# EAGLE design PGTN014_percussive_synth (EAGLE 9.6.0)
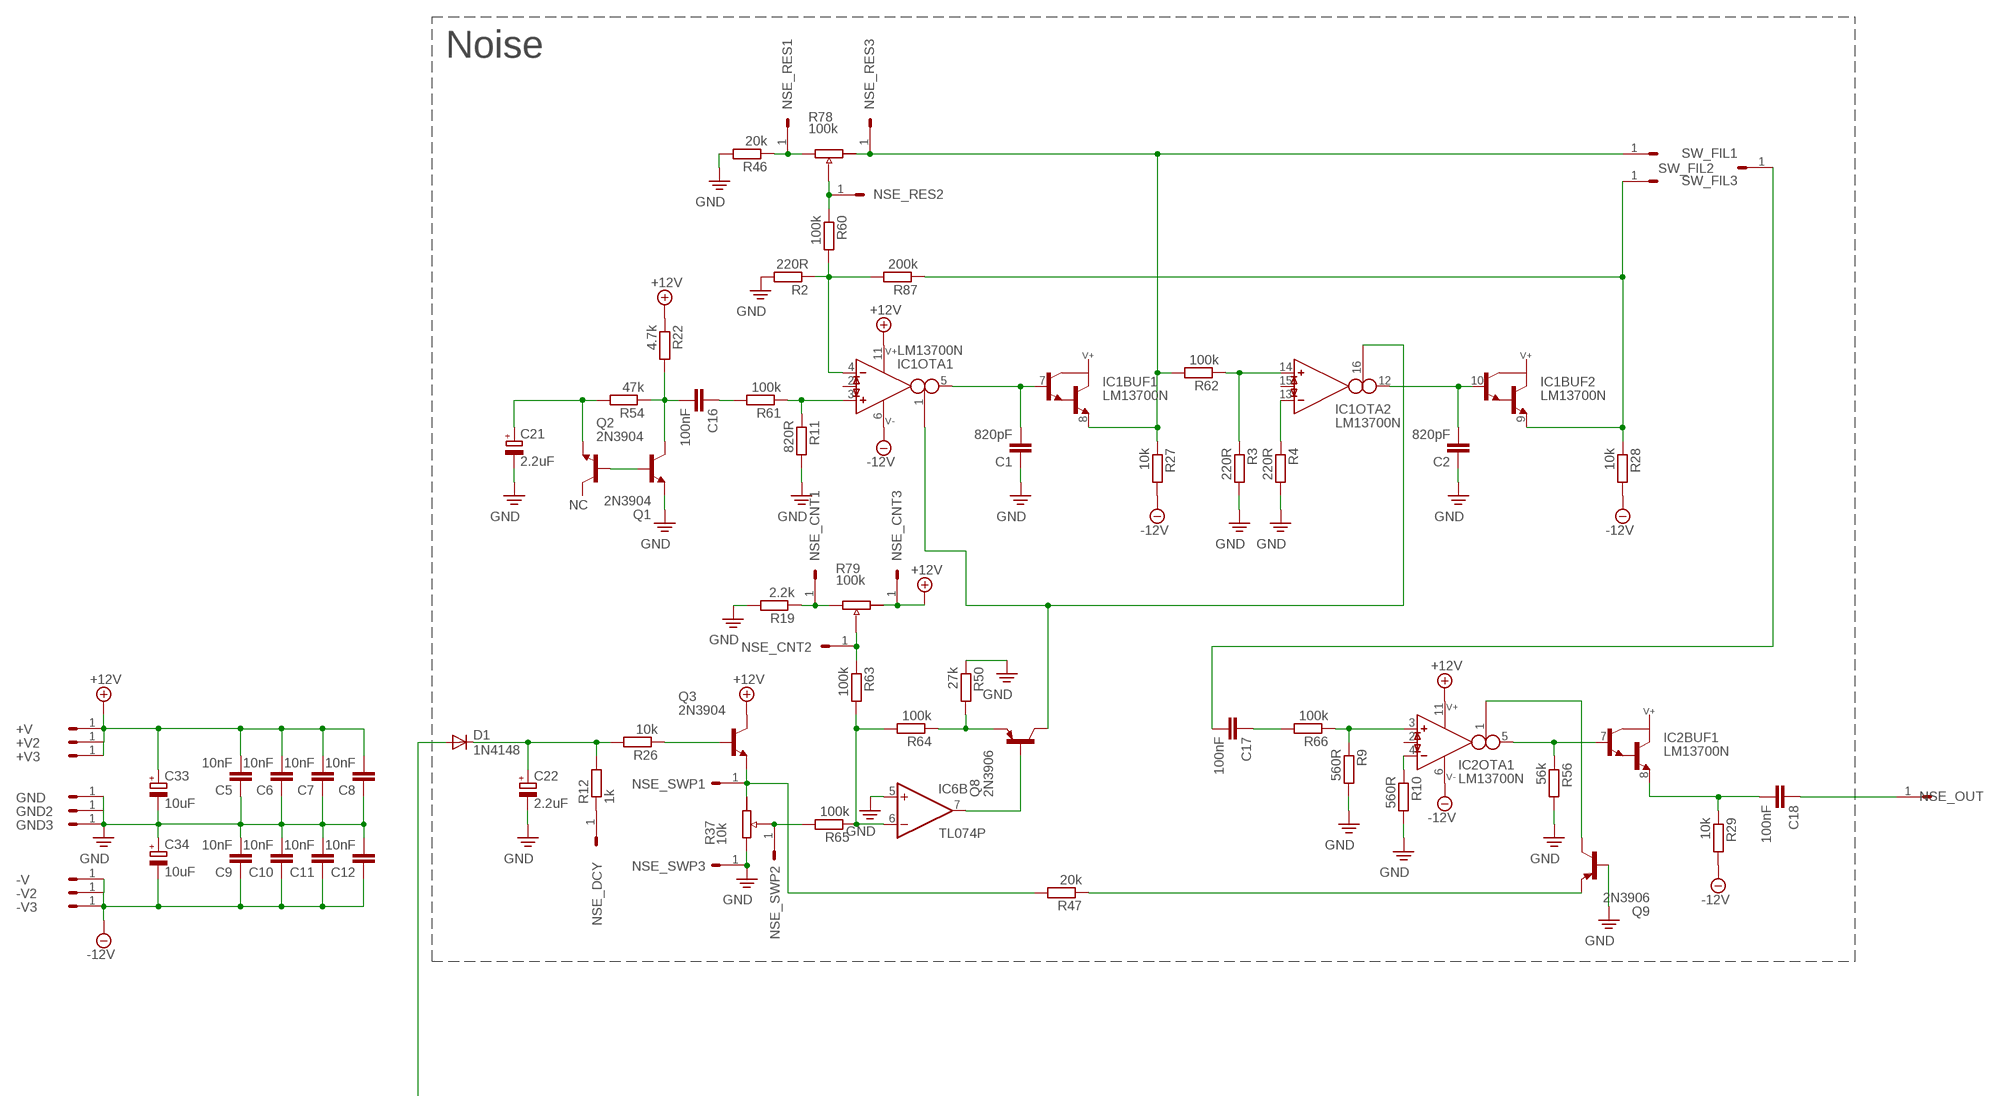
[diagram p0: schematic, sheet 1, part 1 of 2]
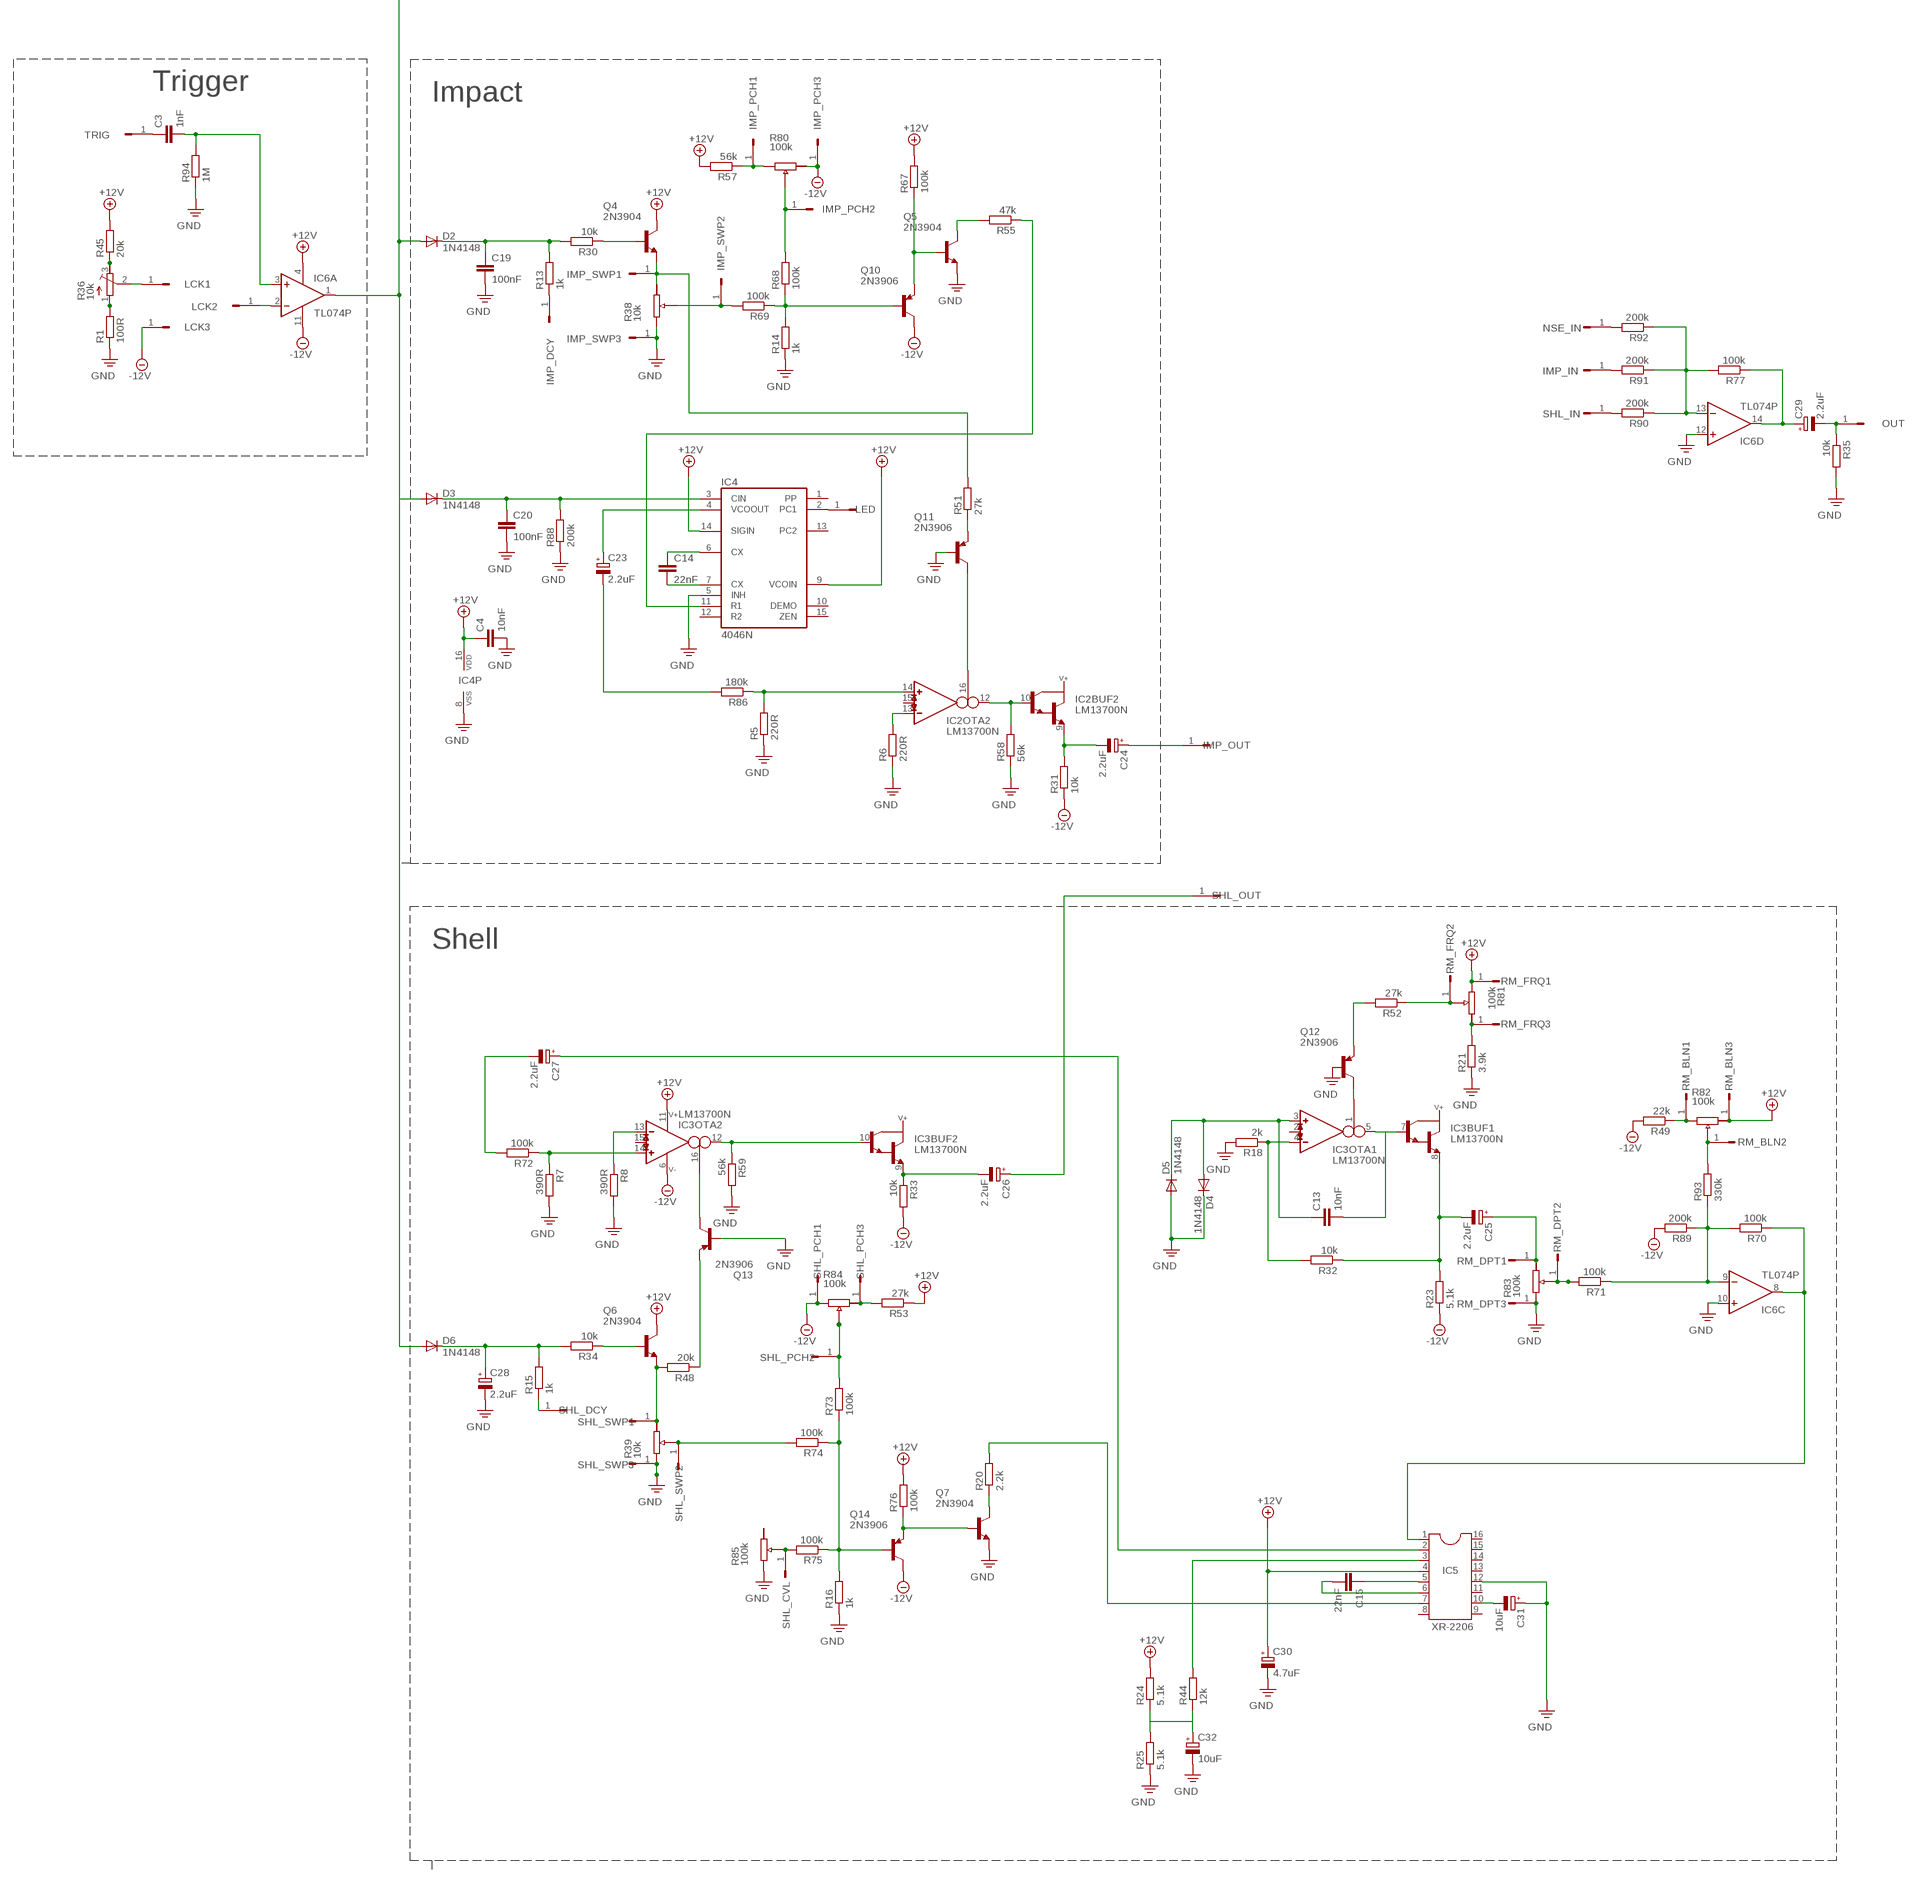
[diagram p1: schematic, sheet 1, part 2 of 2]

## Parts
+V  HEADER/MALE/01  [HEADER/MALE/01]
+V2  HEADER/MALE/01  [HEADER/MALE/01]
+V3  HEADER/MALE/01  [HEADER/MALE/01]
-V  HEADER/MALE/01  [HEADER/MALE/01]
-V2  HEADER/MALE/01  [HEADER/MALE/01]
-V3  HEADER/MALE/01  [HEADER/MALE/01]
C1  820pF  CAPACITORCERAMICDISC/5  [CERAMICDISC/5]
C2  820pF  CAPACITORCERAMICDISC/5  [CERAMICDISC/5]
C3  1nF  CAPACITORCERAMICDISC/5  [CERAMICDISC/5]
C4  10nF  CAPACITORCERAMICDISC/5  [CERAMICDISC/5]
C5  10nF  CAPACITORCERAMICDISC/5  [CERAMICDISC/5]
C6  10nF  CAPACITORCERAMICDISC/5  [CERAMICDISC/5]
C7  10nF  CAPACITORCERAMICDISC/5  [CERAMICDISC/5]
C8  10nF  CAPACITORCERAMICDISC/5  [CERAMICDISC/5]
C9  10nF  CAPACITORCERAMICDISC/5  [CERAMICDISC/5]
C10  10nF  CAPACITORCERAMICDISC/5  [CERAMICDISC/5]
C11  10nF  CAPACITORCERAMICDISC/5  [CERAMICDISC/5]
C12  10nF  CAPACITORCERAMICDISC/5  [CERAMICDISC/5]
C13  10nF  CAPACITORCERAMICDISC/5  [CERAMICDISC/5]
C14  22nF  CAPACITORCERAMICDISC/5  [CERAMICDISC/5]
C15  22nF  CAPACITORCERAMICDISC/5  [CERAMICDISC/5]
C16  100nF  CAPACITORCERAMICDISC/5  [CERAMICDISC/5]
C17  100nF  CAPACITORCERAMICDISC/5  [CERAMICDISC/5]
C18  100nF  CAPACITORCERAMICDISC/5  [CERAMICDISC/5]
C19  100nF  CAPACITORCERAMICDISC/5  [CERAMICDISC/5]
C20  100nF  CAPACITORCERAMICDISC/5  [CERAMICDISC/5]
C21  2.2uF  CAPACITOR/POLARIZEDE2.5-6  [E2,5-6]
C22  2.2uF  CAPACITOR/POLARIZEDE2.5-6  [E2,5-6]
C23  2.2uF  CAPACITOR/POLARIZEDE2.5-6  [E2,5-6]
C24  2.2uF  CAPACITOR/POLARIZEDE2.5-6  [E2,5-6]
C25  2.2uF  CAPACITOR/POLARIZEDE2.5-6  [E2,5-6]
C26  2.2uF  CAPACITOR/POLARIZEDE2.5-6  [E2,5-6]
C27  2.2uF  CAPACITOR/POLARIZEDE2.5-6  [E2,5-6]
C28  2.2uF  CAPACITOR/POLARIZEDE2.5-6  [E2,5-6]
C29  2.2uF  CAPACITOR/POLARIZEDE2.5-6  [E2,5-6]
C30  4.7uF  CAPACITOR/POLARIZEDE2.5-6  [E2,5-6]
C31  10uF  CAPACITOR/POLARIZEDE2.5-6  [E2,5-6]
C32  10uF  CAPACITOR/POLARIZEDE2.5-6  [E2,5-6]
C33  10uF  CAPACITOR/POLARIZEDE2.5-6  [E2,5-6]
C34  10uF  CAPACITOR/POLARIZEDE2.5-6  [E2,5-6]
D1  1N4148  1N4148DO35-7  [DO35-7]
D2  1N4148  1N4148DO35-7  [DO35-7]
D3  1N4148  1N4148DO35-7  [DO35-7]
D4  1N4148  1N4148DO35-7  [DO35-7]
D5  1N4148  1N4148DO35-7  [DO35-7]
D6  1N4148  1N4148DO35-7  [DO35-7]
GND  HEADER/MALE/01  [HEADER/MALE/01]
GND2  HEADER/MALE/01  [HEADER/MALE/01]
GND3  HEADER/MALE/01  [HEADER/MALE/01]
IC1  LM13700N  [DIL16]
IC2  LM13700N  [DIL16]
IC3  LM13700N  [DIL16]
IC4  4046N  [DIL16]
IC5  XR-2206  DIL16  [DIL16]
IC6  TL074P  [DIL14]
IMP_DCY  HEADER/MALE/01  [HEADER/MALE/01]
IMP_IN  HEADER/MALE/01  [HEADER/MALE/01]
IMP_OUT  HEADER/MALE/01  [HEADER/MALE/01]
IMP_PCH1  HEADER/MALE/01  [HEADER/MALE/01]
IMP_PCH2  HEADER/MALE/01  [HEADER/MALE/01]
IMP_PCH3  HEADER/MALE/01  [HEADER/MALE/01]
IMP_SWP1  HEADER/MALE/01  [HEADER/MALE/01]
IMP_SWP2  HEADER/MALE/01  [HEADER/MALE/01]
IMP_SWP3  HEADER/MALE/01  [HEADER/MALE/01]
LCK1  HEADER/MALE/01  [HEADER/MALE/01]
LCK2  HEADER/MALE/01  [HEADER/MALE/01]
LCK3  HEADER/MALE/01  [HEADER/MALE/01]
LED  HEADER/MALE/01  [HEADER/MALE/01]
NSE_CNT1  HEADER/MALE/01  [HEADER/MALE/01]
NSE_CNT2  HEADER/MALE/01  [HEADER/MALE/01]
NSE_CNT3  HEADER/MALE/01  [HEADER/MALE/01]
NSE_DCY  HEADER/MALE/01  [HEADER/MALE/01]
NSE_IN  HEADER/MALE/01  [HEADER/MALE/01]
NSE_OUT  HEADER/MALE/01  [HEADER/MALE/01]
NSE_RES1  HEADER/MALE/01  [HEADER/MALE/01]
NSE_RES2  HEADER/MALE/01  [HEADER/MALE/01]
NSE_RES3  HEADER/MALE/01  [HEADER/MALE/01]
NSE_SWP1  HEADER/MALE/01  [HEADER/MALE/01]
NSE_SWP2  HEADER/MALE/01  [HEADER/MALE/01]
NSE_SWP3  HEADER/MALE/01  [HEADER/MALE/01]
OUT  HEADER/MALE/01  [HEADER/MALE/01]
Q1  2N3904  [TO92]
Q2  2N3904  [TO92]
Q3  2N3904  [TO92]
Q4  2N3904  [TO92]
Q5  2N3904  [TO92]
Q6  2N3904  [TO92]
Q7  2N3904  [TO92]
Q8  2N3906  [TO92]
Q9  2N3906  [TO92]
Q10  2N3906  [TO92]
Q11  2N3906  [TO92]
Q12  2N3906  [TO92]
Q13  2N3906  [TO92]
Q14  2N3906  [TO92]
R1  100R  RESISTORRESISTOR/UPRIGHT/7.5  [RESISTOR/7.5]
R2  220R  RESISTORRESISTOR/UPRIGHT/7.5  [RESISTOR/7.5]
R3  220R  RESISTORRESISTOR/UPRIGHT/7.5  [RESISTOR/7.5]
R4  220R  RESISTORRESISTOR/UPRIGHT/7.5  [RESISTOR/7.5]
R5  220R  RESISTORRESISTOR/UPRIGHT/7.5  [RESISTOR/7.5]
R6  220R  RESISTORRESISTOR/UPRIGHT/7.5  [RESISTOR/7.5]
R7  390R  RESISTORRESISTOR/UPRIGHT/7.5  [RESISTOR/7.5]
R8  390R  RESISTORRESISTOR/UPRIGHT/7.5  [RESISTOR/7.5]
R9  560R  RESISTORRESISTOR/UPRIGHT/7.5  [RESISTOR/7.5]
R10  560R  RESISTORRESISTOR/UPRIGHT/7.5  [RESISTOR/7.5]
R11  820R  RESISTORRESISTOR/UPRIGHT/7.5  [RESISTOR/7.5]
R12  1k  RESISTORRESISTOR/UPRIGHT/7.5  [RESISTOR/7.5]
R13  1k  RESISTORRESISTOR/UPRIGHT/7.5  [RESISTOR/7.5]
R14  1k  RESISTORRESISTOR/UPRIGHT/7.5  [RESISTOR/7.5]
R15  1k  RESISTORRESISTOR/UPRIGHT/7.5  [RESISTOR/7.5]
R16  1k  RESISTORRESISTOR/UPRIGHT/7.5  [RESISTOR/7.5]
R18  2k  RESISTORRESISTOR/UPRIGHT/7.5  [RESISTOR/7.5]
R19  2.2k  RESISTORRESISTOR/UPRIGHT/7.5  [RESISTOR/7.5]
R20  2.2k  RESISTORRESISTOR/UPRIGHT/7.5  [RESISTOR/7.5]
R21  3.9k  RESISTORRESISTOR/UPRIGHT/7.5  [RESISTOR/7.5]
R22  4.7k  RESISTORRESISTOR/UPRIGHT/7.5  [RESISTOR/7.5]
R23  5.1k  RESISTORRESISTOR/UPRIGHT/7.5  [RESISTOR/7.5]
R24  5.1k  RESISTORRESISTOR/UPRIGHT/7.5  [RESISTOR/7.5]
R25  5.1k  RESISTORRESISTOR/UPRIGHT/7.5  [RESISTOR/7.5]
R26  10k  RESISTORRESISTOR/UPRIGHT/7.5  [RESISTOR/7.5]
R27  10k  RESISTORRESISTOR/UPRIGHT/7.5  [RESISTOR/7.5]
R28  10k  RESISTORRESISTOR/UPRIGHT/7.5  [RESISTOR/7.5]
R29  10k  RESISTORRESISTOR/UPRIGHT/7.5  [RESISTOR/7.5]
R30  10k  RESISTORRESISTOR/UPRIGHT/7.5  [RESISTOR/7.5]
R31  10k  RESISTORRESISTOR/UPRIGHT/7.5  [RESISTOR/7.5]
R32  10k  RESISTORRESISTOR/UPRIGHT/7.5  [RESISTOR/7.5]
R33  10k  RESISTORRESISTOR/UPRIGHT/7.5  [RESISTOR/7.5]
R34  10k  RESISTORRESISTOR/UPRIGHT/7.5  [RESISTOR/7.5]
R35  10k  RESISTORRESISTOR/UPRIGHT/7.5  [RESISTOR/7.5]
R36  10k  TRIMMER64X  [TRIMMER/64B]
R37  10k  POTENTIOMETER  (no package)
R38  10k  POTENTIOMETER  (no package)
R39  10k  POTENTIOMETER  (no package)
R44  12k  RESISTORRESISTOR/UPRIGHT/7.5  [RESISTOR/7.5]
R45  20k  RESISTORRESISTOR/UPRIGHT/7.5  [RESISTOR/7.5]
R46  20k  RESISTORRESISTOR/UPRIGHT/7.5  [RESISTOR/7.5]
R47  20k  RESISTORRESISTOR/UPRIGHT/7.5  [RESISTOR/7.5]
R48  20k  RESISTORRESISTOR/UPRIGHT/7.5  [RESISTOR/7.5]
R49  22k  RESISTORRESISTOR/UPRIGHT/7.5  [RESISTOR/7.5]
R50  27k  RESISTORRESISTOR/UPRIGHT/7.5  [RESISTOR/7.5]
R51  27k  RESISTORRESISTOR/UPRIGHT/7.5  [RESISTOR/7.5]
R52  27k  RESISTORRESISTOR/UPRIGHT/7.5  [RESISTOR/7.5]
R53  27k  RESISTORRESISTOR/UPRIGHT/7.5  [RESISTOR/7.5]
R54  47k  RESISTORRESISTOR/UPRIGHT/7.5  [RESISTOR/7.5]
R55  47k  RESISTORRESISTOR/UPRIGHT/7.5  [RESISTOR/7.5]
R56  56k  RESISTORRESISTOR/UPRIGHT/7.5  [RESISTOR/7.5]
R57  56k  RESISTORRESISTOR/UPRIGHT/7.5  [RESISTOR/7.5]
R58  56k  RESISTORRESISTOR/UPRIGHT/7.5  [RESISTOR/7.5]
R59  56k  RESISTORRESISTOR/UPRIGHT/7.5  [RESISTOR/7.5]
R60  100k  RESISTORRESISTOR/UPRIGHT/7.5  [RESISTOR/7.5]
R61  100k  RESISTORRESISTOR/UPRIGHT/7.5  [RESISTOR/7.5]
R62  100k  RESISTORRESISTOR/UPRIGHT/7.5  [RESISTOR/7.5]
R63  100k  RESISTORRESISTOR/UPRIGHT/7.5  [RESISTOR/7.5]
R64  100k  RESISTORRESISTOR/UPRIGHT/7.5  [RESISTOR/7.5]
R65  100k  RESISTORRESISTOR/UPRIGHT/7.5  [RESISTOR/7.5]
R66  100k  RESISTORRESISTOR/UPRIGHT/7.5  [RESISTOR/7.5]
R67  100k  RESISTORRESISTOR/UPRIGHT/7.5  [RESISTOR/7.5]
R68  100k  RESISTORRESISTOR/UPRIGHT/7.5  [RESISTOR/7.5]
R69  100k  RESISTORRESISTOR/UPRIGHT/7.5  [RESISTOR/7.5]
R70  100k  RESISTORRESISTOR/UPRIGHT/7.5  [RESISTOR/7.5]
R71  100k  RESISTORRESISTOR/UPRIGHT/7.5  [RESISTOR/7.5]
R72  100k  RESISTORRESISTOR/UPRIGHT/7.5  [RESISTOR/7.5]
R73  100k  RESISTORRESISTOR/UPRIGHT/7.5  [RESISTOR/7.5]
R74  100k  RESISTORRESISTOR/UPRIGHT/7.5  [RESISTOR/7.5]
R75  100k  RESISTORRESISTOR/UPRIGHT/7.5  [RESISTOR/7.5]
R76  100k  RESISTORRESISTOR/UPRIGHT/7.5  [RESISTOR/7.5]
R77  100k  RESISTORRESISTOR/UPRIGHT/7.5  [RESISTOR/7.5]
R78  100k  POTENTIOMETER  (no package)
R79  100k  POTENTIOMETER  (no package)
R80  100k  POTENTIOMETER  (no package)
R81  100k  POTENTIOMETER  (no package)
R82  100k  POTENTIOMETER  (no package)
R83  100k  POTENTIOMETER  (no package)
R84  100k  POTENTIOMETER  (no package)
R85  100k  POTENTIOMETER  (no package)
R86  180k  RESISTORRESISTOR/UPRIGHT/7.5  [RESISTOR/7.5]
R87  200k  RESISTORRESISTOR/UPRIGHT/7.5  [RESISTOR/7.5]
R88  200k  RESISTORRESISTOR/UPRIGHT/7.5  [RESISTOR/7.5]
R89  200k  RESISTORRESISTOR/UPRIGHT/7.5  [RESISTOR/7.5]
R90  200k  RESISTORRESISTOR/UPRIGHT/7.5  [RESISTOR/7.5]
R91  200k  RESISTORRESISTOR/UPRIGHT/7.5  [RESISTOR/7.5]
R92  200k  RESISTORRESISTOR/UPRIGHT/7.5  [RESISTOR/7.5]
R93  330k  RESISTORRESISTOR/UPRIGHT/7.5  [RESISTOR/7.5]
R94  1M  RESISTORRESISTOR/UPRIGHT/7.5  [RESISTOR/7.5]
RM_BLN1  HEADER/MALE/01  [HEADER/MALE/01]
RM_BLN2  HEADER/MALE/01  [HEADER/MALE/01]
RM_BLN3  HEADER/MALE/01  [HEADER/MALE/01]
RM_DPT1  HEADER/MALE/01  [HEADER/MALE/01]
RM_DPT2  HEADER/MALE/01  [HEADER/MALE/01]
RM_DPT3  HEADER/MALE/01  [HEADER/MALE/01]
RM_FRQ1  HEADER/MALE/01  [HEADER/MALE/01]
RM_FRQ2  HEADER/MALE/01  [HEADER/MALE/01]
RM_FRQ3  HEADER/MALE/01  [HEADER/MALE/01]
SHL_CVL  HEADER/MALE/01  [HEADER/MALE/01]
SHL_DCY  HEADER/MALE/01  [HEADER/MALE/01]
SHL_IN  HEADER/MALE/01  [HEADER/MALE/01]
SHL_OUT  HEADER/MALE/01  [HEADER/MALE/01]
SHL_PCH1  HEADER/MALE/01  [HEADER/MALE/01]
SHL_PCH2  HEADER/MALE/01  [HEADER/MALE/01]
SHL_PCH3  HEADER/MALE/01  [HEADER/MALE/01]
SHL_SWP1  HEADER/MALE/01  [HEADER/MALE/01]
SHL_SWP2  HEADER/MALE/01  [HEADER/MALE/01]
SHL_SWP3  HEADER/MALE/01  [HEADER/MALE/01]
SW_FIL1  HEADER/MALE/01  [HEADER/MALE/01]
SW_FIL2  HEADER/MALE/01  [HEADER/MALE/01]
SW_FIL3  HEADER/MALE/01  [HEADER/MALE/01]
TRIG  HEADER/MALE/01  [HEADER/MALE/01]

## Nets
+12V: +V2.1 +V3.1 +V.1 C4.1 C5.2 C6.2 C7.2 C8.2 C30.+ C33.+ IC1.11(SUPPLY:V+) IC2.11(SUPPLY:V+) IC3.11(SUPPLY:V+) IC4.9(VCOIN) IC4.14(SIGIN) IC4.16(VDD) IC5.4 IC6.4(P:V+) NSE_CNT3.1 Q3.1(C) Q4.1(C) Q6.1(C) R22.1 R24.2 R45.2 R53.1 R57.2 R67.2 R76.2 R79.A R81.E R82.A RM_BLN3.1 RM_FRQ1.1
-12V: -V2.1 -V3.1 -V.1 C9.1 C10.1 C11.1 C12.1 C34.- IC1.6(SUPPLY:V-) IC2.6(SUPPLY:V-) IC3.6(SUPPLY:V-) IC6.11(P:V-) IMP_PCH3.1 LCK3.1 Q10.1(C) Q14.1(C) R23.1 R27.2 R28.2 R29.2 R31.1 R33.2 R49.2 R80.A R84.E R89.2 SHL_PCH1.1
GND: C1.1 C2.1 C4.2 C5.1 C6.1 C7.1 C8.1 C9.2 C10.2 C11.2 C12.2 C19.2 C20.2 C21.- C22.- C28.- C30.- C31.+ C32.- C33.- C34.+ D4.C D5.A GND2.1 GND3.1 GND.1 IC4.5(INH) IC4.8(VSS) IC5.12 IC6.5(B:+IN) IC6.10(C:+IN) IC6.12(D:+IN) IMP_SWP3.1 NSE_SWP3.1 Q2.3(E) Q5.3(E) Q7.3(E) Q9.2(B) Q11.2(B) Q12.2(B) Q13.2(B) R1.1 R2.2 R3.2 R4.2 R5.1 R6.1 R7.2 R8.2 R9.2 R10.2 R11.2 R14.1 R16.1 R18.2 R19.2 R21.1 R25.1 R35.2 R37.E R38.E R39.E R46.2 R50.1 R56.2 R58.1 R59.2 R83.E R85.E R88.1 R94.1 RM_DPT3.1 SHL_SWP3.1
N$1: R36.3(A) R45.1
N$2: R1.2 R36.1(E)
N$3: LCK1.1 R36.2(S)
N$4: IC6.2(A:-IN) LCK2.1
N$5: C3.1 TRIG.1
N$6: C3.2 IC6.3(A:+IN) R94.2
N$7: D1.A D2.A D3.A D6.A IC6.1(A:OUT)
N$8: C22.+ D1.C R12.2 R26.2
N$9: NSE_DCY.1 R12.1
N$10: Q3.2(B) R26.1
N$11: NSE_SWP1.1 Q3.3(E) R37.A R47.2
N$12: IC6.6(B:-IN) R63.2 R64.2 R65.1
N$13: NSE_SWP2.1 R37.S R65.2
N$14: IC6.7(B:OUT) Q8.2(B)
N$15: Q8.3(E) R50.2 R64.1
N$16: NSE_CNT2.1 R63.1 R79.S
N$17: NSE_CNT1.1 R19.1 R79.E
N$18: IC1.1(OTA1:I_BIAS) IC1.16(OTA2:I_BIAS) Q8.1(C)
N$19: C1.2 IC1.5(OTA1:OUT) IC1.7(BUF1:B)
N$20: C2.2 IC1.10(BUF2:B) IC1.12(OTA2:OUT)
N$21: IC1.14(OTA2:IN_P) R3.1 R62.1
N$22: C17.2 SW_FIL2.1
N$23: IC1.13(OTA2:IN_N) R4.1
N$24: IC1.9(BUF2:E) R28.1 R87.1 SW_FIL3.1
N$25: IC1.3(OTA1:IN_P) R11.1 R61.1
N$26: C16.1 R61.2
N$27: C16.2 Q2.1(C) R22.2 R54.1
N$28: C21.+ Q1.3(E) R54.2
N$29: Q1.2(B) Q2.2(B)
N$30: IC1.4(OTA1:IN_N) R2.1 R60.2 R87.2
N$31: NSE_RES2.1 R60.1 R78.S
N$32: NSE_RES1.1 R46.1 R78.E
N$33: IC1.8(BUF1:E) NSE_RES3.1 R27.1 R62.2 R78.A SW_FIL1.1
N$34: C17.1 R66.2
N$35: IC2.3(OTA1:IN_P) R9.1 R66.1
N$36: IC2.5(OTA1:OUT) IC2.7(BUF1:B) R56.1
N$37: IC2.1(OTA1:I_BIAS) Q9.1(C)
N$38: Q9.3(E) R47.1
N$39: IC2.4(OTA1:IN_N) R10.1
N$40: C18.2 IC2.8(BUF1:E) R29.1
N$41: C18.1 NSE_OUT.1
N$42: C19.1 D2.C R13.2 R30.2
N$43: IMP_DCY.1 R13.1
N$44: Q4.2(B) R30.1
N$45: IMP_SWP1.1 Q4.3(E) R38.A R51.2
N$46: IMP_SWP2.1 R38.S R69.2
N$47: Q10.2(B) R14.2 R68.1 R69.1
N$48: IMP_PCH2.1 R68.2 R80.S
N$49: Q5.2(B) Q10.3(E) R67.1
N$50: IMP_PCH1.1 R57.1 R80.E
N$51: Q5.1(C) R55.2
N$52: IC4.11(R1) R55.1
N$53: C20.1 D3.C IC4.3(CIN) R88.2
N$54: IC4.2(PC1) LED.1
N$55: C14.1 IC4.6(CX)
N$56: C14.2 IC4.7(CX)
N$57: C23.+ IC4.4(VCOOUT)
N$58: C23.- R86.2
N$59: IC2.14(OTA2:IN_P) R5.2 R86.1
N$60: Q11.3(E) R51.1
N$61: IC2.16(OTA2:I_BIAS) Q11.1(C)
N$62: IC2.13(OTA2:IN_N) R6.2
N$63: IC2.10(BUF2:B) IC2.12(OTA2:OUT) R58.2
N$64: C24.- IC2.9(BUF2:E) R31.2
N$65: C24.+ IMP_OUT.1
N$66: C28.+ D6.C R15.2 R34.2
N$67: R15.1 SHL_DCY.1
N$68: Q6.2(B) R34.1
N$69: Q6.3(E) R39.A R48.2 SHL_SWP1.1
N$71: R39.S R74.2 SHL_SWP2.1
N$72: Q13.3(E) R48.1
N$73: Q7.1(C) R20.1
N$74: Q14.2(B) R16.2 R73.1 R74.1 R75.1
N$75: R73.2 R84.S SHL_PCH2.1
N$76: R75.2 R85.S SHL_CVL.1
N$77: R53.2 R84.A SHL_PCH3.1
N$78: Q7.2(B) Q14.3(E) R76.1
N$79: IC3.16(OTA2:I_BIAS) Q13.1(C)
N$80: IC3.14(OTA2:IN_P) R7.1 R72.1
N$81: IC3.13(OTA2:IN_N) R8.1
N$82: IC3.10(BUF2:B) IC3.12(OTA2:OUT) R59.1
N$83: C26.- IC3.9(BUF2:E) R33.1
N$84: C27.- R72.2
N$85: C13.2 IC3.5(OTA1:OUT) IC3.7(BUF1:B)
N$86: IC3.4(OTA1:IN_N) R18.1 R32.2
N$87: C13.1 D4.A D5.C IC3.3(OTA1:IN_P)
N$88: C25.- IC3.8(BUF1:E) R23.2 R32.1
N$89: IC3.1(OTA1:I_BIAS) Q12.1(C)
N$90: Q12.3(E) R52.2
N$91: R52.1 R81.S RM_FRQ2.1
N$92: R21.2 R81.A RM_FRQ3.1
N$93: C25.+ R83.A RM_DPT1.1
N$94: R71.2 R83.S RM_DPT2.1
N$95: IC6.9(C:-IN) R70.2 R71.1 R89.1 R93.1
N$96: IC5.1 IC6.8(C:OUT) R70.1
N$97: R82.S R93.2 RM_BLN2.1
N$98: R49.1 R82.E RM_BLN1.1
N$99: C27.+ IC5.2
N$100: IC5.7 R20.2
N$101: C15.1 IC5.5
N$102: C32.+ R24.1 R25.2 R44.1
N$103: IC5.3 R44.2
N$104: C15.2 IC5.6
N$106: C29.+ IC6.14(D:OUT) R77.1
N$107: C26.+ SHL_OUT.1
N$108: IC6.13(D:-IN) R77.2 R90.1 R91.1 R92.1
N$109: NSE_IN.1 R92.2
N$110: IMP_IN.1 R91.2
N$111: R90.2 SHL_IN.1
N$112: C29.- OUT.1 R35.1
N$113: C31.- IC5.10
Unconnected: IC1.2(OTA1:I_DIODE) IC1.15(OTA2:I_DIODE) IC2.2(OTA1:I_DIODE) IC2.15(OTA2:I_DIODE) IC3.2(OTA1:I_DIODE) IC3.15(OTA2:I_DIODE) IC4.1(PP) IC4.10(DEMO) IC4.12(R2) IC4.13(PC2) IC4.15(ZEN) IC5.8 IC5.9 IC5.11 IC5.13 IC5.14 IC5.15 IC5.16 Q1.1(C) R85.A

## Notes on the sheet
- Noise
- NC
- Trigger
- Impact
- Shell

## Library data of the parts
+V +V2 +V3 -V -V2 -V3 GND GND2 GND3 IMP_DCY IMP_IN IMP_OUT IMP_PCH1-IMP_PCH3 IMP_SWP1-IMP_SWP3 LCK1-LCK3 LED NSE_CNT1-NSE_CNT3 NSE_DCY NSE_IN NSE_OUT NSE_RES1-NSE_RES3 NSE_SWP1-NSE_SWP3 OUT RM_BLN1-RM_BLN3 RM_DPT1-RM_DPT3 RM_FRQ1-RM_FRQ3 SHL_CVL SHL_DCY SHL_IN SHL_OUT SHL_PCH1-SHL_PCH3 SHL_SWP1-SHL_SWP3 SW_FIL1-SW_FIL3 TRIG = connectors:HEADER/MALE/01; SPICEPREFIX: X
C1-C20 = capacitors:CAPACITOR: CAPACITOR, European symbol
C21-C34 = capacitors:CAPACITOR/POLARIZED: POLARIZED CAPACITOR, European symbol; SPICEPREFIX: C
D1-D6 = transistors:1N4148: DIODE high speed (Philips)
IC1-IC3 = ic_analogue:LM13700: Dual OTA with buffers
IC4 = ic_digital:4046: Micropower PLL
IC5 = ic_package:DIL16: Dual In Line / Socket
IC6 = ic_analogue:TL074: OP AMP
Q1-Q7 = transistors:2N3904: NPN Transistor
Q8-Q14 = transistors:2N3906: PNP Transistor
R1-R16 R18-R35 R44-R77 R86-R94 = resistors:RESISTOR: RESISTOR, European symbol
R36 = resistors:TRIMMER: Trimm resistor
R37-R39 R78-R85 = controls_off_brd:POTENTIOMETER: Trimm resistor; _EXTERNAL_: 1

## Board
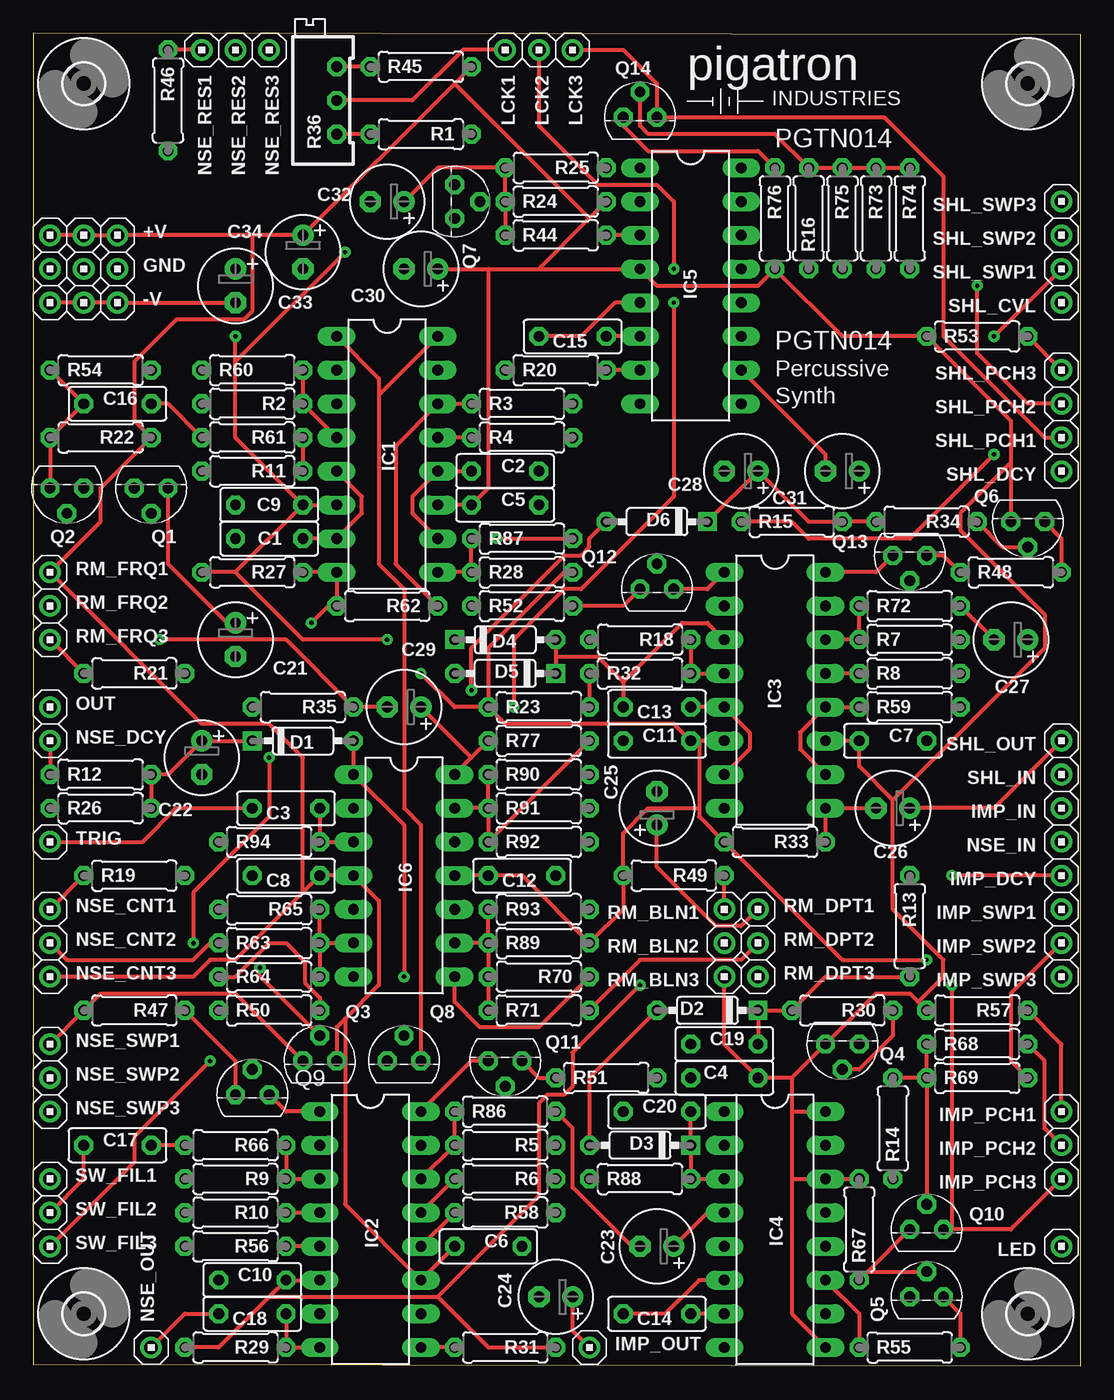
[diagram p2: board, top side]
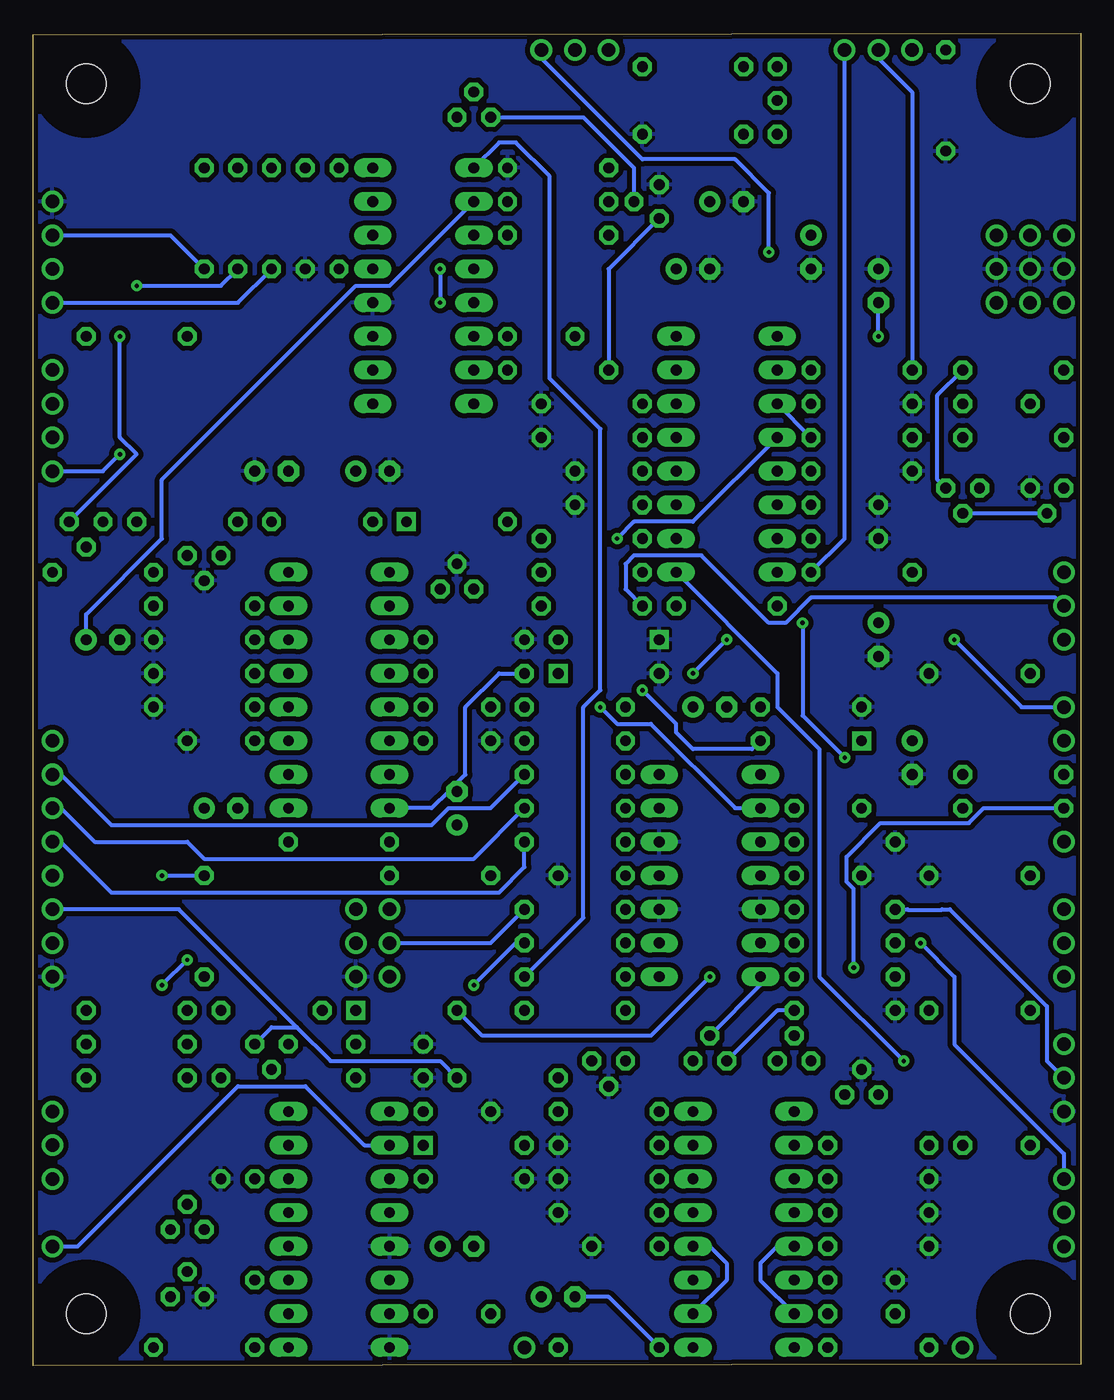
[diagram p3: board, bottom side, seen from below]

Size 78.92 x 100.45 mm. Coordinates in mm from the lower left corner, seen from the top.
Outline: 0,0.13 78.92,0 78.92,100.32 0,100.45 0,0.13
Copper layers (1*16): Top 0.0356mm / dielectric 1.5011mm / Bottom 0.0356mm
Design rules "pigatron": minimum track width 12mil, minimum drill 13mil, track to track 15mil, track to pad 10mil, pad to pad 10mil, via to via 10mil, smd to smd 6mil, copper to edge 15mil, drill to drill 10mil, minimum pad ring 12mil, minimum via ring 10mil, stop-mask expansion 4mil, vias tented up to drill 0mil, thermal gap 10mil

### Footprints (pad centres in the part's own frame; a part is rotated, then mirrored left to right if it is on the bottom)
HEADER/MALE/01 = drill 1.016: 1 0,0
CERAMICDISC/5 = drill 0.813 octagon: 1 -2.54,0; 2 2.54,0
E2,5-6 = drill 0.813 pad 1.6: + -1.27,0 | drill 0.813 pad 1.6 octagon: - 1.27,0
DO35-7 = drill 0.813 octagon: A 3.81,0 | drill 0.813 square: C -3.81,0
DIL16 = drill 0.813 long: 1 -8.89,-3.81; 2 -6.35,-3.81; 3 -3.81,-3.81; 4 -1.27,-3.81; 5 1.27,-3.81; 6 3.81,-3.81; 7 6.35,-3.81; 8 8.89,-3.81; 9 8.89,3.81; 10 6.35,3.81; 11 3.81,3.81; 12 1.27,3.81; 13 -1.27,3.81; 14 -3.81,3.81; 15 -6.35,3.81; 16 -8.89,3.81
DIL14 = drill 0.813 long: 1 -7.62,-3.81; 2 -5.08,-3.81; 3 -2.54,-3.81; 4 0,-3.81; 5 2.54,-3.81; 6 5.08,-3.81; 7 7.62,-3.81; 8 7.62,3.81; 9 5.08,3.81; 10 2.54,3.81; 11 0,3.81; 12 -2.54,3.81; 13 -5.08,3.81; 14 -7.62,3.81
TO92 = drill 0.813 octagon: 1 1.27,0; 2 0,1.905; 3 -1.27,0
RESISTOR/7.5 = drill 0.813 octagon: 1 -3.81,0; 2 3.81,0
TRIMMER/64B = drill 0.813 octagon: 1 1.27,-2.54; 2 1.27,0; 3 1.27,2.54
STANDOFF/3.0 = hole 3: 0,0

### Placement (x,y rotation side)
+V  6.35,85.22 0 top
+V2  3.81,85.22 0 top
+V3  1.27,85.22 0 top
-V  6.35,80.14 0 top
-V2  3.81,80.14 0 top
-V3  1.27,80.14 0 top
C1  17.78,62.36 0 top
C2  35.56,67.44 180 top
C3  19.05,42.04 0 top
C4  52.07,21.72 180 top
C5  35.56,64.9 180 top
C6  34.29,9.02 180 top
C7  64.77,47.12 180 top
C8  19.05,36.96 0 top
C9  17.78,64.9 180 top
C10  16.51,6.48 180 top
C11  46.99,47.12 180 top
C12  36.83,36.96 0 top
C13  46.99,49.66 0 top
C14  46.99,3.94 0 top
C15  40.64,77.6 0 top
C16  6.35,72.52 180 top
C17  6.35,16.64 180 top
C18  16.51,3.94 0 top
C19  52.07,24.26 180 top
C20  46.99,19.18 180 top
C21  15.24,54.74 270 top
C22  12.7,45.85 270 top
C23  46.99,9.02 180 top
C24  39.37,5.21 180 top
C25  46.99,42.04 90 top
C26  64.77,42.04 180 top
C27  73.66,54.74 180 top
C28  53.34,67.44 180 top
C29  27.94,49.66 180 top
C30  29.21,82.68 180 top
C31  60.96,67.44 180 top
C32  26.67,87.76 180 top
C33  20.32,83.95 270 top
C34  15.24,81.41 270 top
D1  20.32,47.12 0 top
D2  50.8,26.8 180 top
D3  45.72,16.64 180 top
D4  35.56,54.74 0 top
D5  35.56,52.2 180 top
D6  46.99,63.63 180 top
GND  6.35,82.68 0 top
GND2  1.27,82.68 0 top
GND3  3.81,82.68 0 top
IC1  26.67,68.71 270 top
IC2  25.4,10.29 270 top
IC3  55.88,50.93 270 top
IC4  55.88,10.29 270 top
IC5  49.53,81.41 270 top
IC6  27.94,36.96 270 top
IMP_DCY  77.47,36.96 180 top
IMP_IN  77.47,42.04 180 top
IMP_OUT  41.91,1.4 0 top
IMP_PCH1  77.47,19.18 180 top
IMP_PCH2  77.47,16.64 180 top
IMP_PCH3  77.47,14.1 180 top
IMP_SWP1  77.47,34.42 180 top
IMP_SWP2  77.47,31.88 180 top
IMP_SWP3  77.47,29.34 180 top
LCK1  35.56,99.19 270 top
LCK2  38.1,99.19 270 top
LCK3  40.64,99.19 270 top
LED  77.47,9.02 180 top
NSE_CNT1  1.27,34.42 0 top
NSE_CNT2  1.27,31.88 0 top
NSE_CNT3  1.27,29.34 0 top
NSE_DCY  1.27,47.12 0 top
NSE_IN  77.47,39.5 180 top
NSE_OUT  8.89,1.4 90 top
NSE_RES1  12.7,99.19 270 top
NSE_RES2  15.24,99.19 270 top
NSE_RES3  17.78,99.19 270 top
NSE_SWP1  1.27,24.26 0 top
NSE_SWP2  1.27,21.72 0 top
NSE_SWP3  1.27,19.18 0 top
OUT  1.27,49.66 0 top
Q1  8.89,66.17 180 top
Q2  2.54,66.17 180 top
Q3  21.59,22.99 0 top
Q4  60.96,24.26 180 top
Q5  67.31,5.21 0 top
Q6  74.93,63.63 180 top
Q7  31.75,87.76 270 top
Q8  27.94,22.99 0 top
Q9  16.51,20.45 0 top
Q10  67.31,10.29 0 top
Q11  35.56,22.99 180 top
Q12  46.99,58.55 0 top
Q13  66.04,61.09 180 top
Q14  45.72,94.11 0 top
R1  29.21,92.84 180 top
R2  16.51,72.52 180 top
R3  36.83,72.52 0 top
R4  36.83,69.98 0 top
R5  35.56,16.64 180 top
R6  35.56,14.1 180 top
R7  66.04,54.74 0 top
R8  66.04,52.2 0 top
R9  15.24,14.1 180 top
R10  15.24,11.56 180 top
R11  16.51,67.44 180 top
R12  5.08,44.58 0 top
R13  66.04,33.15 270 top
R14  64.77,17.91 90 top
R15  57.15,63.63 0 top
R16  58.42,86.49 90 top
R18  45.72,54.74 180 top
R19  7.62,36.96 0 top
R20  39.37,75.06 0 top
R21  7.62,52.2 180 top
R22  5.08,69.98 180 top
R23  38.1,49.66 0 top
R24  39.37,87.76 0 top
R25  39.37,90.3 180 top
R26  5.08,42.04 0 top
R27  16.51,59.82 180 top
R28  36.83,59.82 0 top
R29  15.24,1.4 180 top
R30  60.96,26.8 180 top
R31  35.56,1.4 180 top
R32  45.72,52.2 0 top
R33  55.88,39.5 180 top
R34  67.31,63.63 180 top
R35  20.32,49.66 180 top
R36  21.59,95.38 0 top
R44  39.37,85.22 0 top
R45  29.21,97.92 0 top
R46  10.16,95.38 270 top
R47  7.62,26.8 180 top
R48  73.66,59.82 0 top
R49  48.26,36.96 180 top
R50  17.78,26.8 0 top
R51  43.18,21.72 0 top
R52  36.83,57.28 0 top
R53  71.12,77.6 0 top
R54  5.08,75.06 0 top
R55  66.04,1.4 0 top
R56  15.24,9.02 180 top
R57  71.12,26.8 180 top
R58  35.56,11.56 180 top
R59  66.04,49.66 0 top
R60  16.51,75.06 0 top
R61  16.51,69.98 180 top
R62  26.67,57.28 180 top
R63  17.78,31.88 0 top
R64  17.78,29.34 0 top
R65  17.78,34.42 180 top
R66  15.24,16.64 180 top
R67  62.23,10.29 90 top
R68  71.12,24.26 0 top
R69  71.12,21.72 0 top
R70  38.1,29.34 180 top
R71  38.1,26.8 0 top
R72  66.04,57.28 0 top
R73  63.5,86.49 270 top
R74  66.04,86.49 270 top
R75  60.96,86.49 270 top
R76  55.88,86.49 270 top
R77  38.1,47.12 0 top
R86  35.56,19.18 0 top
R87  36.83,62.36 0 top
R88  45.72,14.1 0 top
R89  38.1,31.88 0 top
R90  38.1,44.58 0 top
R91  38.1,42.04 0 top
R92  38.1,39.5 0 top
R93  38.1,34.42 0 top
R94  17.78,39.5 0 top
RM_BLN1  52.07,34.42 180 top
RM_BLN2  52.07,31.88 180 top
RM_BLN3  52.07,29.34 180 top
RM_DPT1  54.61,34.42 0 top
RM_DPT2  54.61,31.88 0 top
RM_DPT3  54.61,29.34 0 top
RM_FRQ1  1.27,59.82 0 top
RM_FRQ2  1.27,57.28 0 top
RM_FRQ3  1.27,54.74 0 top
SHL_CVL  77.47,80.14 180 top
SHL_DCY  77.47,67.44 180 top
SHL_IN  77.47,44.58 180 top
SHL_OUT  77.47,47.12 180 top
SHL_PCH1  77.47,69.98 180 top
SHL_PCH2  77.47,72.52 180 top
SHL_PCH3  77.47,75.06 180 top
SHL_SWP1  77.47,82.68 180 top
SHL_SWP2  77.47,85.22 180 top
SHL_SWP3  77.47,87.76 180 top
SW_FIL1  1.27,14.1 0 top
SW_FIL2  1.27,11.56 0 top
SW_FIL3  1.27,9.02 0 top
TRIG  1.27,39.5 0 top
U$1  [STANDOFF/3.0]  3.81,96.65 0 top
U$2  [STANDOFF/3.0]  3.81,3.94 0 top
U$3  [STANDOFF/3.0]  74.93,3.94 0 top
U$4  [STANDOFF/3.0]  74.93,96.65 0 top
U$5  [PIGATRON-LOGO]  58.17,96.9 0 top

### Tracks (layer width: path | path; a pad name or v marks a point on that pad's centre or on a via)
+12V
  Top 0.305: C6.2 IC2.11 23.5,12.19 23.5,26.16 | Q3.1 22.86,25.53 23.5,26.16 | 23.5,26.16 26.04,28.7 26.04,35.05 IC6.4 C8.2 20.32,35.69 | NSE_CNT3.1 12.06,29.34 13.34,30.61 15.24,30.61 20.32,35.69 | 20.32,35.69 20.32,45.85 17.78,48.39 12.7,48.39 RM_FRQ1.1 5.08,63.63 5.08,66.17 R22.1 7.62,71.25 7.62,75.69 10.79,78.87 15.88,78.87 16.51,79.5 16.51,85.22 | IC3.11 C7.2 62.23,45.21 64.77,42.67 | 57.15,21.72 C4.1 52.07,24.26 RM_BLN3.1 | 57.15,21.72 Q4.1 63.5,28.07 66.04,28.07 66.67,27.43 | IC4.9 57.15,3.94 57.15,14.1 | 57.15,21.72 57.15,19.18 | 57.15,19.18 57.15,14.1 | 57.15,14.1 IC4.14 R67.2 | 57.15,19.18 IC4.16 | 66.67,27.43 R57.2 | 64.77,42.67 64.77,34.42 68.58,30.61 68.58,29.34 66.67,27.43 | +V3.1 +V2.1 +V.1 16.51,85.22 | 31.75,96.65 C33.+ 16.51,85.22 | 31.75,96.65 R45.2 | 73.66,68.07 73.66,71.25 R53.1 60.96,77.6 R76.2 54.61,81.41 46.99,81.41 IC5.4 38.1,82.68 | 73.66,68.07 Q6.1 | IC1.11 C5.2 34.29,66.17 34.29,82.68 | C30.+ 34.29,82.68 | 34.29,82.68 38.1,82.68 | 38.1,82.68 41.91,86.49 | 41.91,86.49 R24.2 | 41.91,86.49 31.75,96.65 | 64.77,42.67 76.2,54.1 76.2,56.64 69.85,62.99 69.85,64.26 73.66,68.07
-12V  (via drill 0.33)
  Top 0.305: LCK3.1 44.45,99.19 46.99,96.65 Q14.1 64.14,94.11 68.58,89.66 68.58,77.6 76.2,69.98 SHL_PCH1.1 | -V3.1 -V2.1 -V.1 C34.- | 15.24,59.82 R27.2 | C9.1 15.24,59.82 | C9.1 IC1.6 | 15.24,75.69 15.24,69.98 C9.1 | 15.24,75.69 v15.24,77.6 | R29.2 13.97,1.4 17.78,5.21 | 17.78,5.21 C10.1 IC2.6 | R31.1 34.29,1.4 30.48,5.21 | 17.78,5.21 30.48,5.21 | R23.1 34.29,54.1 40.01,59.82 R28.2 | 69.22,10.29 73.66,10.29 IMP_PCH3.1 | IC3.6 50.16,47.12 | 50.16,47.12 50.16,42.04 | 50.16,42.04 50.16,41.4 R33.2 60.96,30.61 v67.31,30.61 | 50.16,47.12 C11.1 48.26,48.39 35.56,48.39 R23.1 | IC6.11 C12.1 36.83,36.96 R89.2 44.45,34.42 R49.2 44.45,40.13 46.35,42.04 50.16,42.04 | v69.22,28.7 69.22,10.29 | 69.22,10.29 Q10.1 | 30.48,5.21 38.1,12.83 38.1,19.81 38.73,20.45 40.01,20.45 40.64,21.08 40.64,23.62 v45.72,28.7 | 15.24,59.82 20.32,54.74 v26.67,54.74 | v29.21,52.2 31.75,49.66 R23.1 | 15.24,75.69 v23.5,83.95
  Bottom 0.305: v15.24,77.6 C34.- | v67.31,30.61 v69.22,28.7 | v45.72,28.7 42.55,31.88 R89.2 | v29.21,52.2 v26.67,54.74 | LCK3.1 40.64,98.55 33.02,90.93 26.04,90.93 23.5,88.39 v23.5,83.95
GND
  pour Bottom: 0,100.46 0,0.13 78.74,0.13 78.74,100.46
N$1
  Top 0.305: R45.1 R36.3
N$2
  Top 0.305: R1.2 R36.1
N$3
  Top 0.305: R36.2 28.57,95.38 32.38,99.19 LCK1.1
N$4  (via drill 0.33)
  Top 0.305: v36.2,49.66 36.2,54.74 40.01,58.55 41.27,58.55 48.26,65.53 v48.26,80.14 | v48.26,82.68 48.26,87.76 46.99,89.03 42.55,89.03 38.1,93.47 LCK2.1
  Bottom 0.305: IC6.2 26.04,42.04 32.38,48.39 34.92,48.39 v36.2,49.66 | v48.26,82.68 v48.26,80.14
N$5
  Top 0.305: C3.1 10.79,42.04 8.26,39.5 TRIG.1
N$6
  Top 0.305: C3.2 R94.2 IC6.3
N$7  (via drill 0.33)
  Top 0.305: D3.A 41.91,21.72 D2.A | D1.A IC6.1 27.94,40.77 v27.94,29.34 | D6.A 41.91,62.36 41.91,61.72 41.27,61.09 40.01,61.09 33.02,54.1 v33.02,50.93
  Bottom 0.305: v33.02,50.93 30.48,48.39 30.48,47.75 29.21,46.48 24.77,46.48 D1.A | D2.A 45.09,24.89 32.38,24.89 v27.94,29.34
N$8
  Top 0.305: R26.2 R12.2 10.16,44.58 C22.+ D1.C
N$9
  Top 0.305: NSE_DCY.1 R12.1
N$10  (via drill 0.35)
  Top 0.305: Q3.2 17,29.49 17,30.12 v17.1,30.02
  Bottom 0.305: R26.1 7.31,42.04 8.43,40.92 15.09,40.92 17.63,38.38 17.63,36.49 17.1,35.97 v17.1,30.02
N$11
  Top 0.305: NSE_SWP1.1 R47.2 5.08,28.07 15.24,28.07 Q3.3
N$12
  Top 0.305: R63.2 R64.2 | R63.2 IC6.6 | R63.2 R65.1
N$13
  Bottom 0.305: R65.2 13.04,34.42 12.98,34.37 10.51,34.37 10.46,34.42 9.85,34.42 2.54,27.11 2.54,22.99 NSE_SWP2.1
N$14
  Bottom 0.305: Q8.2 24.13,28.7 IC6.7
N$15
  Top 0.305: R64.1 15.24,29.34 17.78,31.88 19.05,31.88 20.47,30.45 20.47,28.87 21.59,27.76 R50.2
  Bottom 0.305: Q8.3 22.86,26.8 R50.2
N$16
  Top 0.305: R63.1 13.34,31.88 12.06,30.61 2.54,30.61 NSE_CNT2.1
N$17
  Top 0.305: NSE_CNT1.1 R19.1
N$18
  Top 0.305: Q8.1 29.21,40.77 27.94,42.04 27.94,58.55 26.04,60.45 26.04,73.15 | 26.04,73.15 26.04,74.42 IC1.1 | 26.04,73.15 IC1.16
N$19
  Top 0.305: C1.2 IC1.7 24.77,64.26 24.77,65.53 IC1.5
N$20
  Top 0.305: IC1.10 28.57,64.26 28.57,65.53 IC1.12 C2.2
N$21
  Top 0.305: R62.1 27.3,60.45 27.3,69.34 IC1.14 R3.1
N$22
  Top 0.305: C17.2 3.81,14.1 SW_FIL2.1
N$23
  Top 0.305: R4.1 IC1.13
N$24  (via drill 0.33)
  Top 0.305: IC1.9 R28.1 R87.1 | SW_FIL3.1 7.62,15.37 7.62,17.27 v13.34,22.99
  Bottom 0.305: v13.34,22.99 19.68,29.34 19.68,46.48 22.86,49.66 22.86,52.2 IC1.9
N$25
  Top 0.305: R61.1 R11.1
  Bottom 0.305: R61.1 IC1.3
N$26
  Top 0.305: C16.1 10.16,72.52 R61.2
N$27
  Top 0.305: Q2.1 R22.2 C16.2 R54.1
N$28
  Top 0.305: Q1.3 10.16,60.45 14.61,56.01 C21.+
  Bottom 0.305: R54.2 10.79,73.15 10.79,66.8 Q1.3
N$29
  Bottom 0.305: Q1.2 Q2.2
N$30  (via drill 0.33)
  Top 0.305: R60.2 R2.1 IC1.4 | v34.92,62.36 R87.2
  Bottom 0.305: v34.92,62.36 33.66,63.63 29.21,63.63 IC1.4
N$31
  Bottom 0.305: R60.1 12.7,96.01 15.24,98.55 NSE_RES2.1
N$32
  Top 0.305: NSE_RES1.1 R46.1
N$33  (via drill 0.33)
  Top 0.305: R27.1 IC1.8 22.86,57.91 | v12.06,31.88 12.06,35.69 17.78,41.4 v17.78,45.85 | 22.86,57.91 v20.95,56.01 | 22.86,57.91 R62.2
  Bottom 0.305: SW_FIL1.1 1.27,16 9.53,24.26 9.53,29.34 v12.06,31.88 | v17.78,45.85 20.95,49.02 v20.95,56.01 | NSE_RES3.1 17.78,62.36 R27.1
N$34
  Top 0.305: R66.2 C17.1
N$35
  Top 0.305: R66.1 R9.1 IC2.3
N$36
  Top 0.305: IC2.5 R56.1
  Bottom 0.305: IC2.7 24.13,6.48 24.13,7.75 22.86,9.02 IC2.5
N$37
  Top 0.305: IC2.1 19.05,19.18 Q9.1
N$38
  Top 0.305: R47.1 15.24,22.99 Q9.3
N$39
  Top 0.305: IC2.4 R10.1
N$40
  Top 0.305: C18.2 R29.1 IC2.8
N$41
  Top 0.305: C18.1 11.43,3.94 NSE_OUT.1
N$42
  Top 0.305: C19.1 D2.C R30.2 59.69,29.34 R13.2
N$43  (via drill 0.33)
  Top 0.305: IMP_DCY.1 v69.22,36.96
  Bottom 0.305: v69.22,36.96 R13.1
N$44
  Top 0.305: Q4.2 62.23,22.35 64.77,24.89 R30.1
N$45
  Bottom 0.305: 59.05,25.53 60.96,25.53 Q4.3 | IMP_SWP1.1 67.94,34.42 59.05,25.53 | 59.05,25.53 56.52,22.99 48.26,22.99 R51.2
N$46
  Top 0.305: R69.2 73.66,22.99 73.66,28.07 IMP_SWP2.1
N$47
  Top 0.305: R69.1 Q10.2 | R69.1 R14.2 | R69.1 R68.1
N$48
  Top 0.305: R68.2 76.2,22.99 76.2,17.91 IMP_PCH2.1
N$49
  Top 0.305: Q10.3 62.87,7.11 | 62.87,7.11 R67.1 | 62.87,7.11 Q5.2
N$50
  Top 0.305: R57.1 77.47,24.26 IMP_PCH1.1
N$51
  Top 0.305: R55.2 69.85,3.94 Q5.1
N$52
  Top 0.305: R55.1 62.23,3.94 IC4.11
N$53
  Top 0.305: IC4.3 R88.2 D3.C C20.1
N$54
  Bottom 0.305: IC4.2 53.98,16.64 58.42,21.08 63.5,21.08 75.56,9.02 LED.1
N$55
  Top 0.305: C14.1 47.62,3.94 50.16,6.48 IC4.6
N$56
  Top 0.305: IC4.7 C14.2
N$57
  Top 0.305: IC4.4 50.8,11.56 C23.+
N$58
  Top 0.305: R86.2 40.64,17.91 40.64,13.46 45.09,9.02 C23.-
N$59
  Top 0.305: IC2.14 R5.2 R86.1
N$60
  Top 0.305: R51.1 38.1,21.72 Q11.3
N$61
  Top 0.305: IC2.16 33.02,22.99 Q11.1
N$62
  Top 0.305: R6.2 IC2.13
N$63
  Top 0.305: IC2.12 R58.2
  Bottom 0.305: IC2.10 26.67,6.48 26.67,7.75 27.94,9.02 IC2.12
N$64
  Top 0.305: R31.2 IC2.9
  Bottom 0.305: C24.- 35.56,5.21 R31.2
N$65
  Top 0.305: C24.+ 40.64,2.67 IMP_OUT.1
N$66
  Top 0.305: R34.2 R15.2 58.42,63.63 C28.+ D6.C
N$67  (via drill 0.33)
  Top 0.305: R15.1 57.15,63.63 58.42,62.36 66.04,62.36 v72.39,68.71
  Bottom 0.305: v72.39,68.71 73.66,67.44 SHL_DCY.1
N$68
  Top 0.305: Q6.2 73.03,61.72 R34.1
N$69  (via drill 0.33)
  Top 0.305: R48.2 77.47,62.36 Q6.3 | v72.39,77.6 SHL_SWP1.1
  Bottom 0.305: v72.39,77.6 72.39,69.98 71.12,68.71 Q6.3
N$71
  Bottom 0.305: R74.2 68.58,85.22 SHL_SWP2.1
N$72
  Top 0.305: Q13.3 68.58,61.09 R48.1
N$73
  Bottom 0.305: R20.1 35.56,82.68 Q7.1
N$74
  Top 0.305: Q14.2 45.72,93.47 46.35,92.84 55.88,92.84 R16.2 R75.1 R73.1 R74.1
N$75  (via drill 0.33)
  Top 0.305: v71.12,81.41 71.12,76.33 74.93,72.52 SHL_PCH2.1
  Bottom 0.305: R73.2 64.77,81.41 v71.12,81.41
N$76
  Bottom 0.305: R75.2 63.5,80.14 SHL_CVL.1
N$77
  Top 0.305: SHL_PCH3.1 R53.2
N$78
  Top 0.305: R76.1 54.61,91.57 46.35,91.57 44.45,93.47 Q14.3
  Bottom 0.305: Q7.2 33.66,90.3 37.47,94.11 Q14.3
N$79
  Top 0.305: IC3.16 63.5,59.82 Q13.1
N$80
  Top 0.305: IC3.14 R7.1 R72.1
N$81
  Top 0.305: R8.1 IC3.13
N$82
  Top 0.305: IC3.10 57.78,46.48 57.78,47.75 IC3.12 R59.1
N$83
  Top 0.305: R33.1 IC3.9 C26.-
N$84
  Top 0.305: C27.- R72.2
N$85
  Top 0.305: IC3.7 53.98,46.48 53.98,47.75 IC3.5 C13.2
N$86
  Top 0.305: R18.1 R32.2 IC3.4
N$87
  Top 0.305: D4.A 39.37,53.47 | 39.37,53.47 D5.C | 44.45,51.56 C13.1 | 44.45,51.56 42.55,53.47 39.37,53.47 | IC3.3 50.8,56.01 48.9,56.01 44.45,51.56
N$88
  Top 0.305: R32.1 R23.2
  Bottom 0.305: IC3.8 48.9,42.04 47.62,43.31 | R32.1 43.81,52.2 46.35,49.66 46.35,44.58 47.62,43.31 | 47.62,43.31 C25.-
N$89
  Top 0.305: Q12.1 50.8,58.55 IC3.1
N$90
  Top 0.305: R52.2 44.45,57.28 Q12.3
N$91
  Bottom 0.305: R52.1 34.29,58.55 34.29,60.45 33.66,61.09 28.57,61.09 23.5,56.01 22.23,56.01 20.32,57.91 1.91,57.91 RM_FRQ2.1
N$92
  Top 0.305: RM_FRQ3.1 R21.2
N$93
  Top 0.305: C25.+ 46.99,37.59 51.44,33.15 53.34,33.15 RM_DPT1.1
N$94
  Top 0.305: R71.2 45.72,30.61 53.34,30.61 RM_DPT2.1
N$95
  Top 0.305: R71.1 R70.2 R89.1 | R89.1 IC6.9 | R89.1 R93.1
N$96
  Top 0.305: IC6.8 31.75,27.43 33.66,25.53 38.1,25.53 R70.1
  Bottom 0.305: IC5.1 43.81,92.2 42.55,92.2 40.01,89.66 40.01,74.42 36.2,70.61 36.2,50.93 37.47,49.66 37.47,33.78 R70.1
N$97
  Bottom 0.305: R93.2 44.45,31.88 RM_BLN2.1
N$98
  Top 0.305: RM_BLN1.1 R49.1
N$99
  Bottom 0.305: IC5.2 52.07,81.41 54.61,81.41 69.22,66.8 69.22,62.36 74.93,56.64 C27.+
N$100
  Top 0.305: IC5.7 R20.2
N$101
  Top 0.305: C15.1 41.27,77.6 43.81,80.14 IC5.5
N$102
  Top 0.305: R44.1 R24.1 R25.2 30.48,90.3 C32.+
N$103
  Top 0.305: IC5.3 R44.2
N$104
  Top 0.305: IC5.6 C15.2
N$106
  Top 0.305: R77.1 33.02,45.85 | 33.02,45.85 IC6.14 | 33.02,45.85 C29.+
N$107
  Top 0.305: C26.+ 72.39,42.04 SHL_OUT.1
N$108
  Top 0.305: R91.1 R92.1 R77.2 | R91.1 IC6.13 | R91.1 R90.1
N$109
  Bottom 0.305: R92.2 41.91,37.59 43.81,35.69 73.03,35.69 76.83,39.5 NSE_IN.1
N$110
  Bottom 0.305: R91.2 45.72,38.23 66.04,38.23 67.31,39.5 74.3,39.5 76.83,42.04 IMP_IN.1
N$111
  Bottom 0.305: R90.2 44.45,42.04 47.62,42.04 48.9,40.77 73.03,40.77 76.83,44.58 SHL_IN.1
N$112  (via drill 0.33)
  Top 0.305: C29.- R35.1 19.05,54.74 v9.53,54.74
  Bottom 0.305: OUT.1 4.45,49.66 v9.53,54.74
N$113
  Top 0.305: IC5.10 59.69,68.71 C31.-

### Text on the board
tNames: PGTN014 | PGTN014 | Percussive | Synth